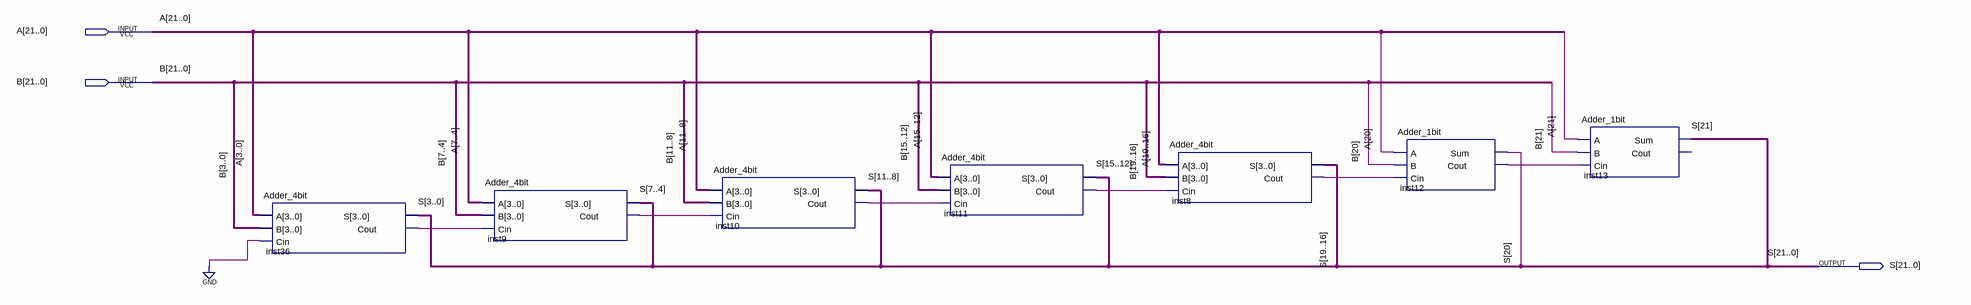
[diagram p0: schematic sheet]
// Quartus schematic Adder_22bit.bdf as structural Verilog: 7 symbols, 3 pins
module Adder_22bit (
  input  [21:0] A,
  input  [21:0] B,
  output [21:0] S
);

  wire inst8_cout, inst9_cout, inst10_cout, inst11_cout, inst12_cout, inst36_cout;

  Adder_4bit inst36 (.A(A[3:0]), .B(B[3:0]), .Cin(1'b0), .S(S[3:0]), .Cout(inst36_cout));
  Adder_4bit inst9 (.A(A[7:4]), .B(B[7:4]), .Cin(inst36_cout), .S(S[7:4]), .Cout(inst9_cout));
  Adder_4bit inst10 (.A(A[11:8]), .B(B[11:8]), .Cin(inst9_cout), .S(S[11:8]), .Cout(inst10_cout));
  Adder_4bit inst11 (.A(A[15:12]), .B(B[15:12]), .Cin(inst10_cout), .S(S[15:12]), .Cout(inst11_cout));
  Adder_4bit inst8 (.A(A[19:16]), .B(B[19:16]), .Cin(inst11_cout), .S(S[19:16]), .Cout(inst8_cout));
  Adder_1bit inst12 (.A(A[20]), .B(B[20]), .Cin(inst8_cout), .Sum(S[20]), .Cout(inst12_cout));
  Adder_1bit inst13 (.A(A[21]), .B(B[21]), .Cin(inst12_cout), .Sum(S[21]));  // open: Cout
endmodule
